# Altium schematic sheet ADCs.SCHDOC
size B
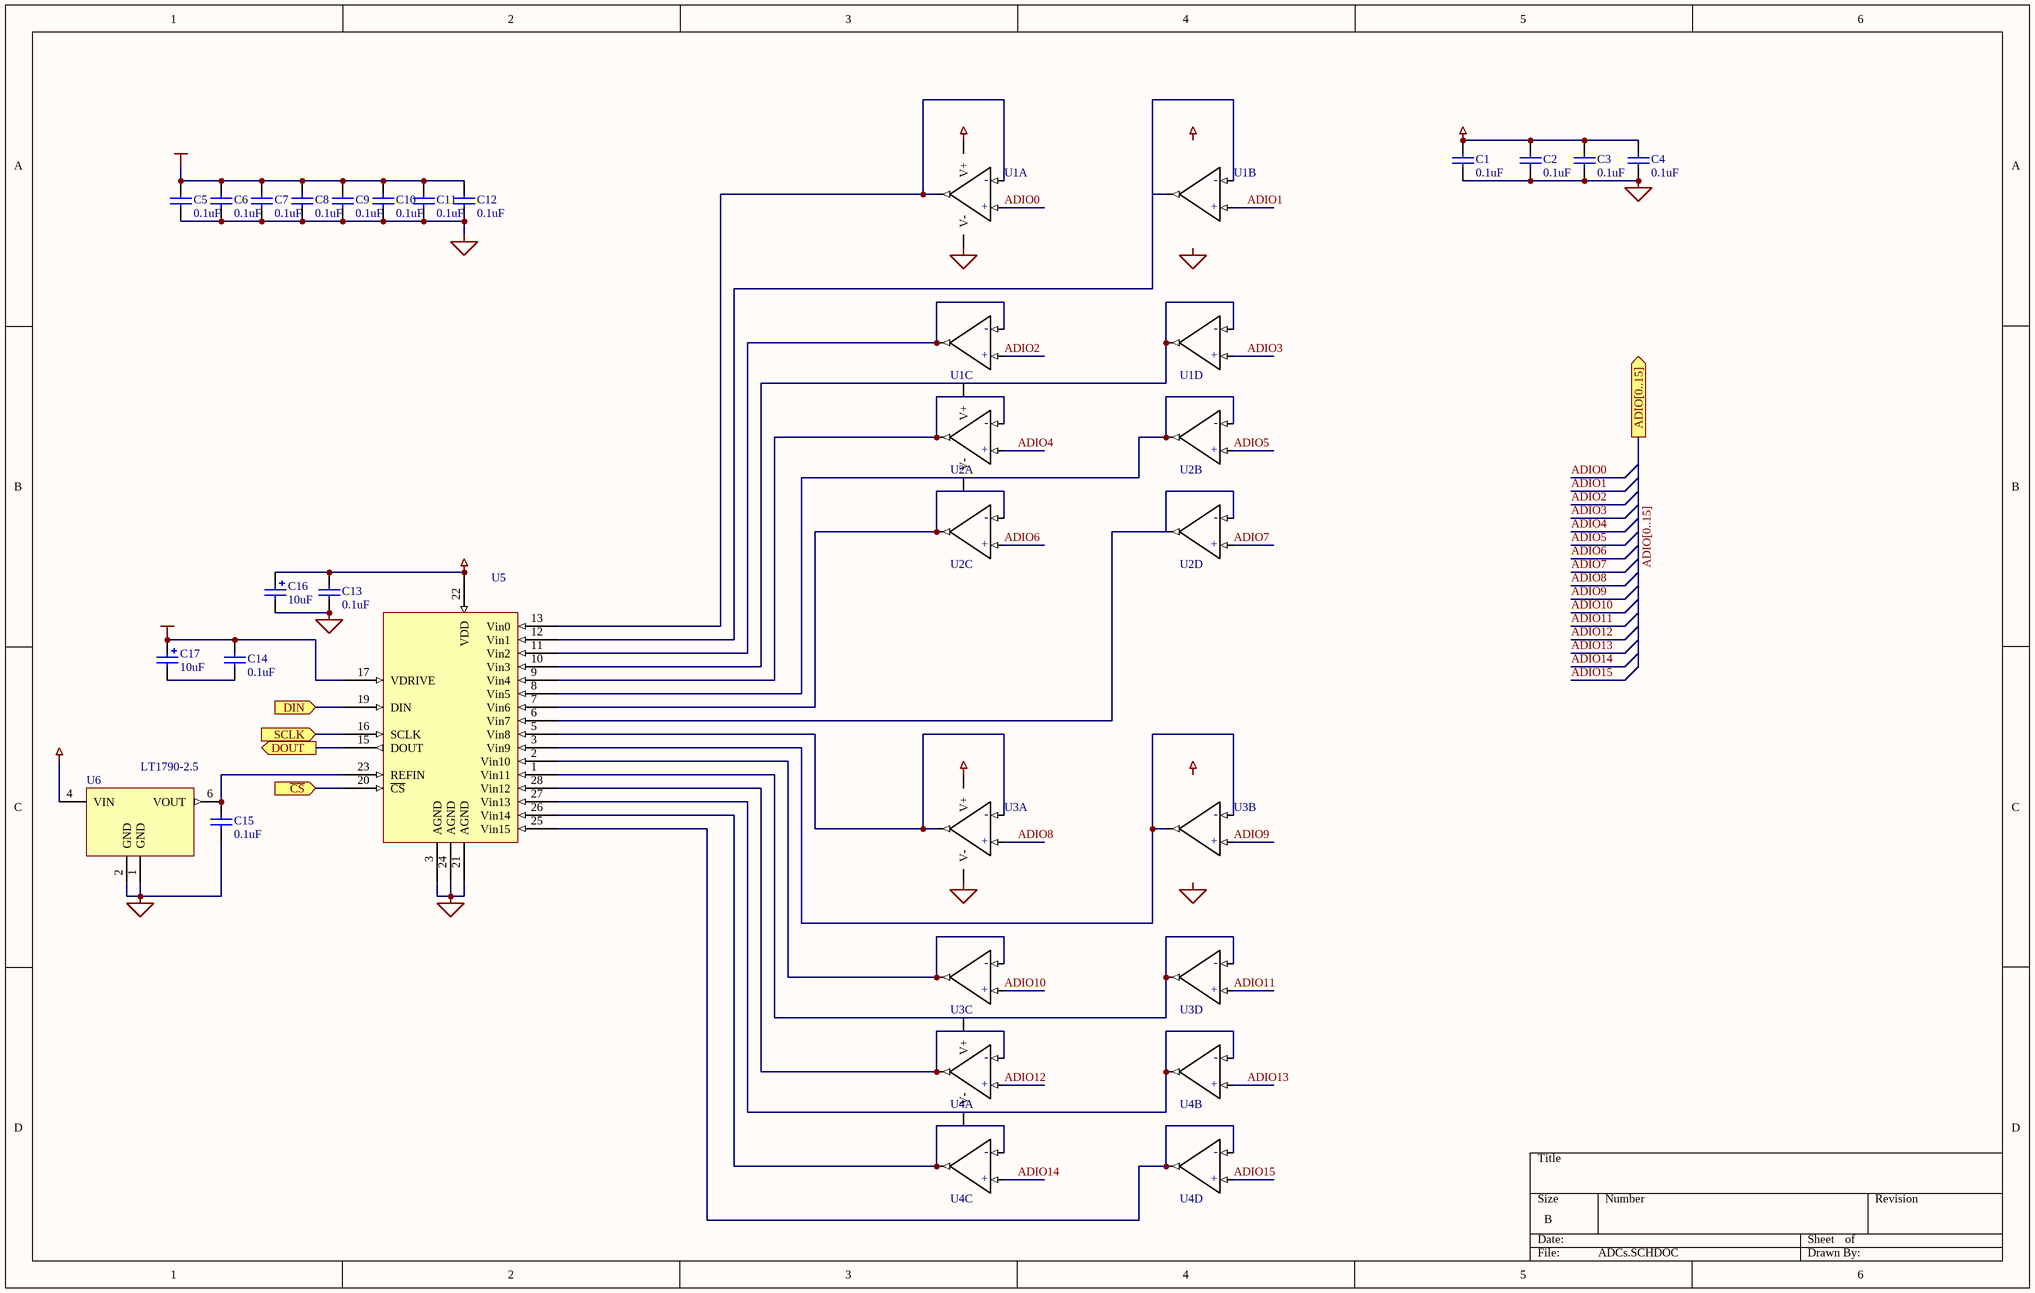
[diagram p0: ADCs.SCHDOC]

## Parts
C1  value 0.1uF  [CC1608-0603]  (hidden comment: Cap)
C2  value 0.1uF  [CC1608-0603]  (hidden comment: Cap)
C3  value 0.1uF  [CC1608-0603]  (hidden comment: Cap)
C4  value 0.1uF  [CC1608-0603]  (hidden comment: Cap)
C5  value 0.1uF  [CC1608-0603]  (hidden comment: Cap)
C6  value 0.1uF  [CC1608-0603]  (hidden comment: Cap)
C7  value 0.1uF  [CC1608-0603]  (hidden comment: Cap)
C8  value 0.1uF  [CC1608-0603]  (hidden comment: Cap)
C9  value 0.1uF  [CC1608-0603]  (hidden comment: Cap)
C10  value 0.1uF  [CC1608-0603]  (hidden comment: Cap)
C11  value 0.1uF  [CC1608-0603]  (hidden comment: Cap)
C12  value 0.1uF  [CC1608-0603]  (hidden comment: Cap)
C13  value 0.1uF  [CC1608-0603]  (hidden comment: Cap)
C14  value 0.1uF  [CC1608-0603]  (hidden comment: Cap)
C15  value 0.1uF  [CC1608-0603]  (hidden comment: Cap)
C16  value 10uF  [TC3528-1411]  (hidden comment: Tantalum)
C17  value 10uF  [TC3528-1411]  (hidden comment: Tantalum)
U1  OP496  [SO-G14]  (value not drawn)  (parts A,B,C,D of 4)
U2  OP496  [SO-G14]  (value not drawn)  (parts A,B,C,D of 4)
U3  OP496  [SO-G14]  (value not drawn)  (parts A,B,C,D of 4)
U4  OP496  [SO-G14]  (value not drawn)  (parts A,B,C,D of 4)
U5  (no value)  [SSO-G28/X.45]
U6  LT1790-2.5  [LTI SOT-23 ThinSOT]

## Ports
ADIO[0..15] (out), DIN (in), DOUT (out), SCLK (in), ~{CS} (in)

## Nets
+5VCC: C5.2 C6.2 C7.2 C8.2 C9.2 C10.2 C11.2 C12.2
AVDD: C1.2 C2.2 C3.2 C4.2 C13.2 C16.1 U1.4(V+) U3.4(V+) U5.22(VDD) U6.4(VIN)
GND: C1.1 C2.1 C3.1 C4.1 C5.1 C6.1 C7.1 C8.1 C9.1 C10.1 C11.1 C12.1 C13.1 C15.2 C16.2 U5.3(AGND) U5.21(AGND) U5.24(AGND) U6.1(GND) U6.2(GND)
SGND: U1.11(V-) U3.11(V-)
VCC: C14.2 C17.1 U5.17(VDRIVE)
ADIO0: U1.3(+INA)
ADIO1: U1.5(+INB)
ADIO2: U1.10(+INC)
ADIO3: U1.12(+IND)
ADIO4: U2.3(+INA)
ADIO5: U2.5(+INB)
ADIO6: U2.10(+INC)
ADIO7: U2.12(+IND)
ADIO8: U3.3(+INA)
ADIO9: U3.5(+INB)
ADIO10: U3.10(+INC)
ADIO11: U3.12(+IND)
ADIO12: U4.3(+INA)
ADIO13: U4.5(+INB)
ADIO14: U4.10(+INC)
ADIO15: U4.12(+IND)
~{CS}: U5.20(~{CS}) ; port ~{CS}
DIN: U5.19(DIN) ; port DIN
DOUT: U5.15(DOUT) ; port DOUT
SCLK: U5.16(SCLK) ; port SCLK
NetC14_1: C14.1 C17.2
NetC15_1: C15.1 U5.23(REFIN) U6.6(VOUT)
NetU1_1: U1.1(OUTA) U1.2(-INA) U5.13(Vin0)
NetU1_6: U1.6(-INB) U1.7(OUTB) U5.12(Vin1)
NetU1_8: U1.8(OUTC) U1.9(-INC) U5.11(Vin2)
NetU1_13: U1.13(-IND) U1.14(OUTD) U2.4(V+) U5.10(Vin3)
NetU2_1: U2.1(OUTA) U2.2(-INA) U5.9(Vin4)
NetU2_6: U2.6(-INB) U2.7(OUTB) U5.8(Vin5)
NetU2_8: U2.8(OUTC) U2.9(-INC) U2.11(V-) U5.7(Vin6)
NetU2_13: U2.13(-IND) U2.14(OUTD) U5.6(Vin7)
NetU3_1: U3.1(OUTA) U3.2(-INA) U5.5(Vin8)
NetU3_6: U3.6(-INB) U3.7(OUTB) U5.3(Vin9)
NetU3_8: U3.8(OUTC) U3.9(-INC) U5.2(Vin10)
NetU3_13: U3.13(-IND) U3.14(OUTD) U4.4(V+) U5.1(Vin11)
NetU4_1: U4.1(OUTA) U4.2(-INA) U5.28(Vin12)
NetU4_6: U4.6(-INB) U4.7(OUTB) U5.27(Vin13)
NetU4_8: U4.8(OUTC) U4.9(-INC) U4.11(V-) U5.26(Vin14)
NetU4_13: U4.13(-IND) U4.14(OUTD) U5.25(Vin15)

## Buses and harness runs
bus ADIO[0..15] = port ADIO[0..15]

## Notes on the sheet
- Labels drawn without touching a wire or pin: AVDD, SGND
- (in symbol OP496, part A) -; +
- (in symbol OP496, part B) -; +
- (in symbol OP496, part C) -; +
- (in symbol OP496, part D) -; +

## Library data of the parts
C1-C15 = Cap: Capacitor; Manufacturer: Generic Components; Class I: Passive; Published: 8-Jun-2000; Revision: July-2002: Re-released for DXP Platform.; Publisher: Altium Limited; Class II: Capacitor
C16 C17 = Cap Pol1: Polarized Capacitor (Radial); Manufacturer: Generic Components; Class I: Passive; Published: 8-Jun-2000; Revision: July-2002: Re-released for DXP Platform.; Publisher: Altium Limited; Class II: Capacitor
U1-U4 = OP496: AD quad RRIO OA
U5 = AD7490BRU: AD 16-chan 12-bit ADC
U6 = LT1790: Micropower SOT-23 Low Dropout Reference Family